# Altium schematic sheet GTM_PowerConnector.SchDoc
size A4
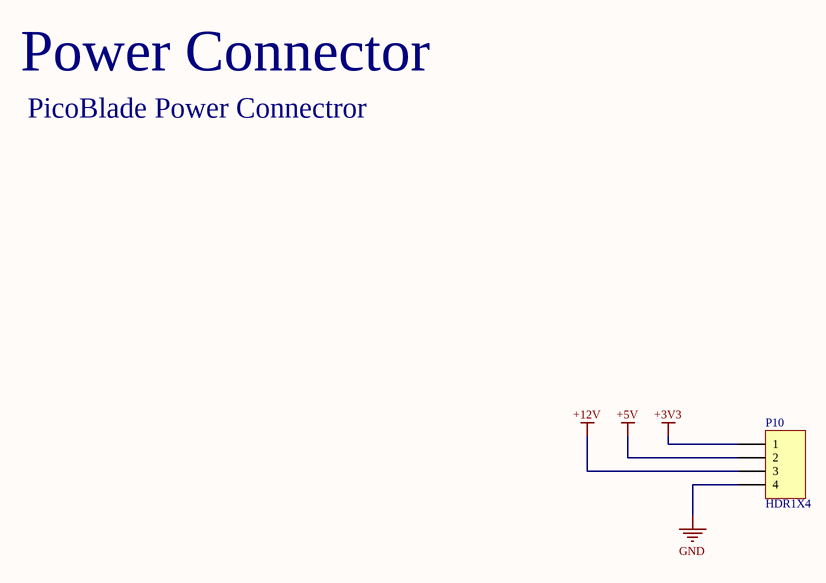
[diagram p0: GTM_PowerConnector.SchDoc]

## Parts
P10  HDR1X4  [PicoBlade SMD Angle 4 Circuits]

## Nets
+3V3: P10.1
+5V: P10.2
+12V: P10.3
GND: P10.4

## Notes on the sheet
- Power Connector
- PicoBlade Power Connectror
- Project
- Rev.
- Title
- Drawn by
- Date
- Sheet
- of
- Checked by

## Library data of the parts
P10 = HDR1X4: Header, 4-Pin; LatestRevisionDate: 17-Jul-2002; LatestRevisionNote: Re-released for DXP Platform.; Publisher: Altium Limited